# Altium schematic sheet 09- CAN.SchDoc: CAN
size 420 x 297 mm; Revision: 1.0; SheetNumber: 9; SheetTotal: 13; Project: LOW LEVEL ECU
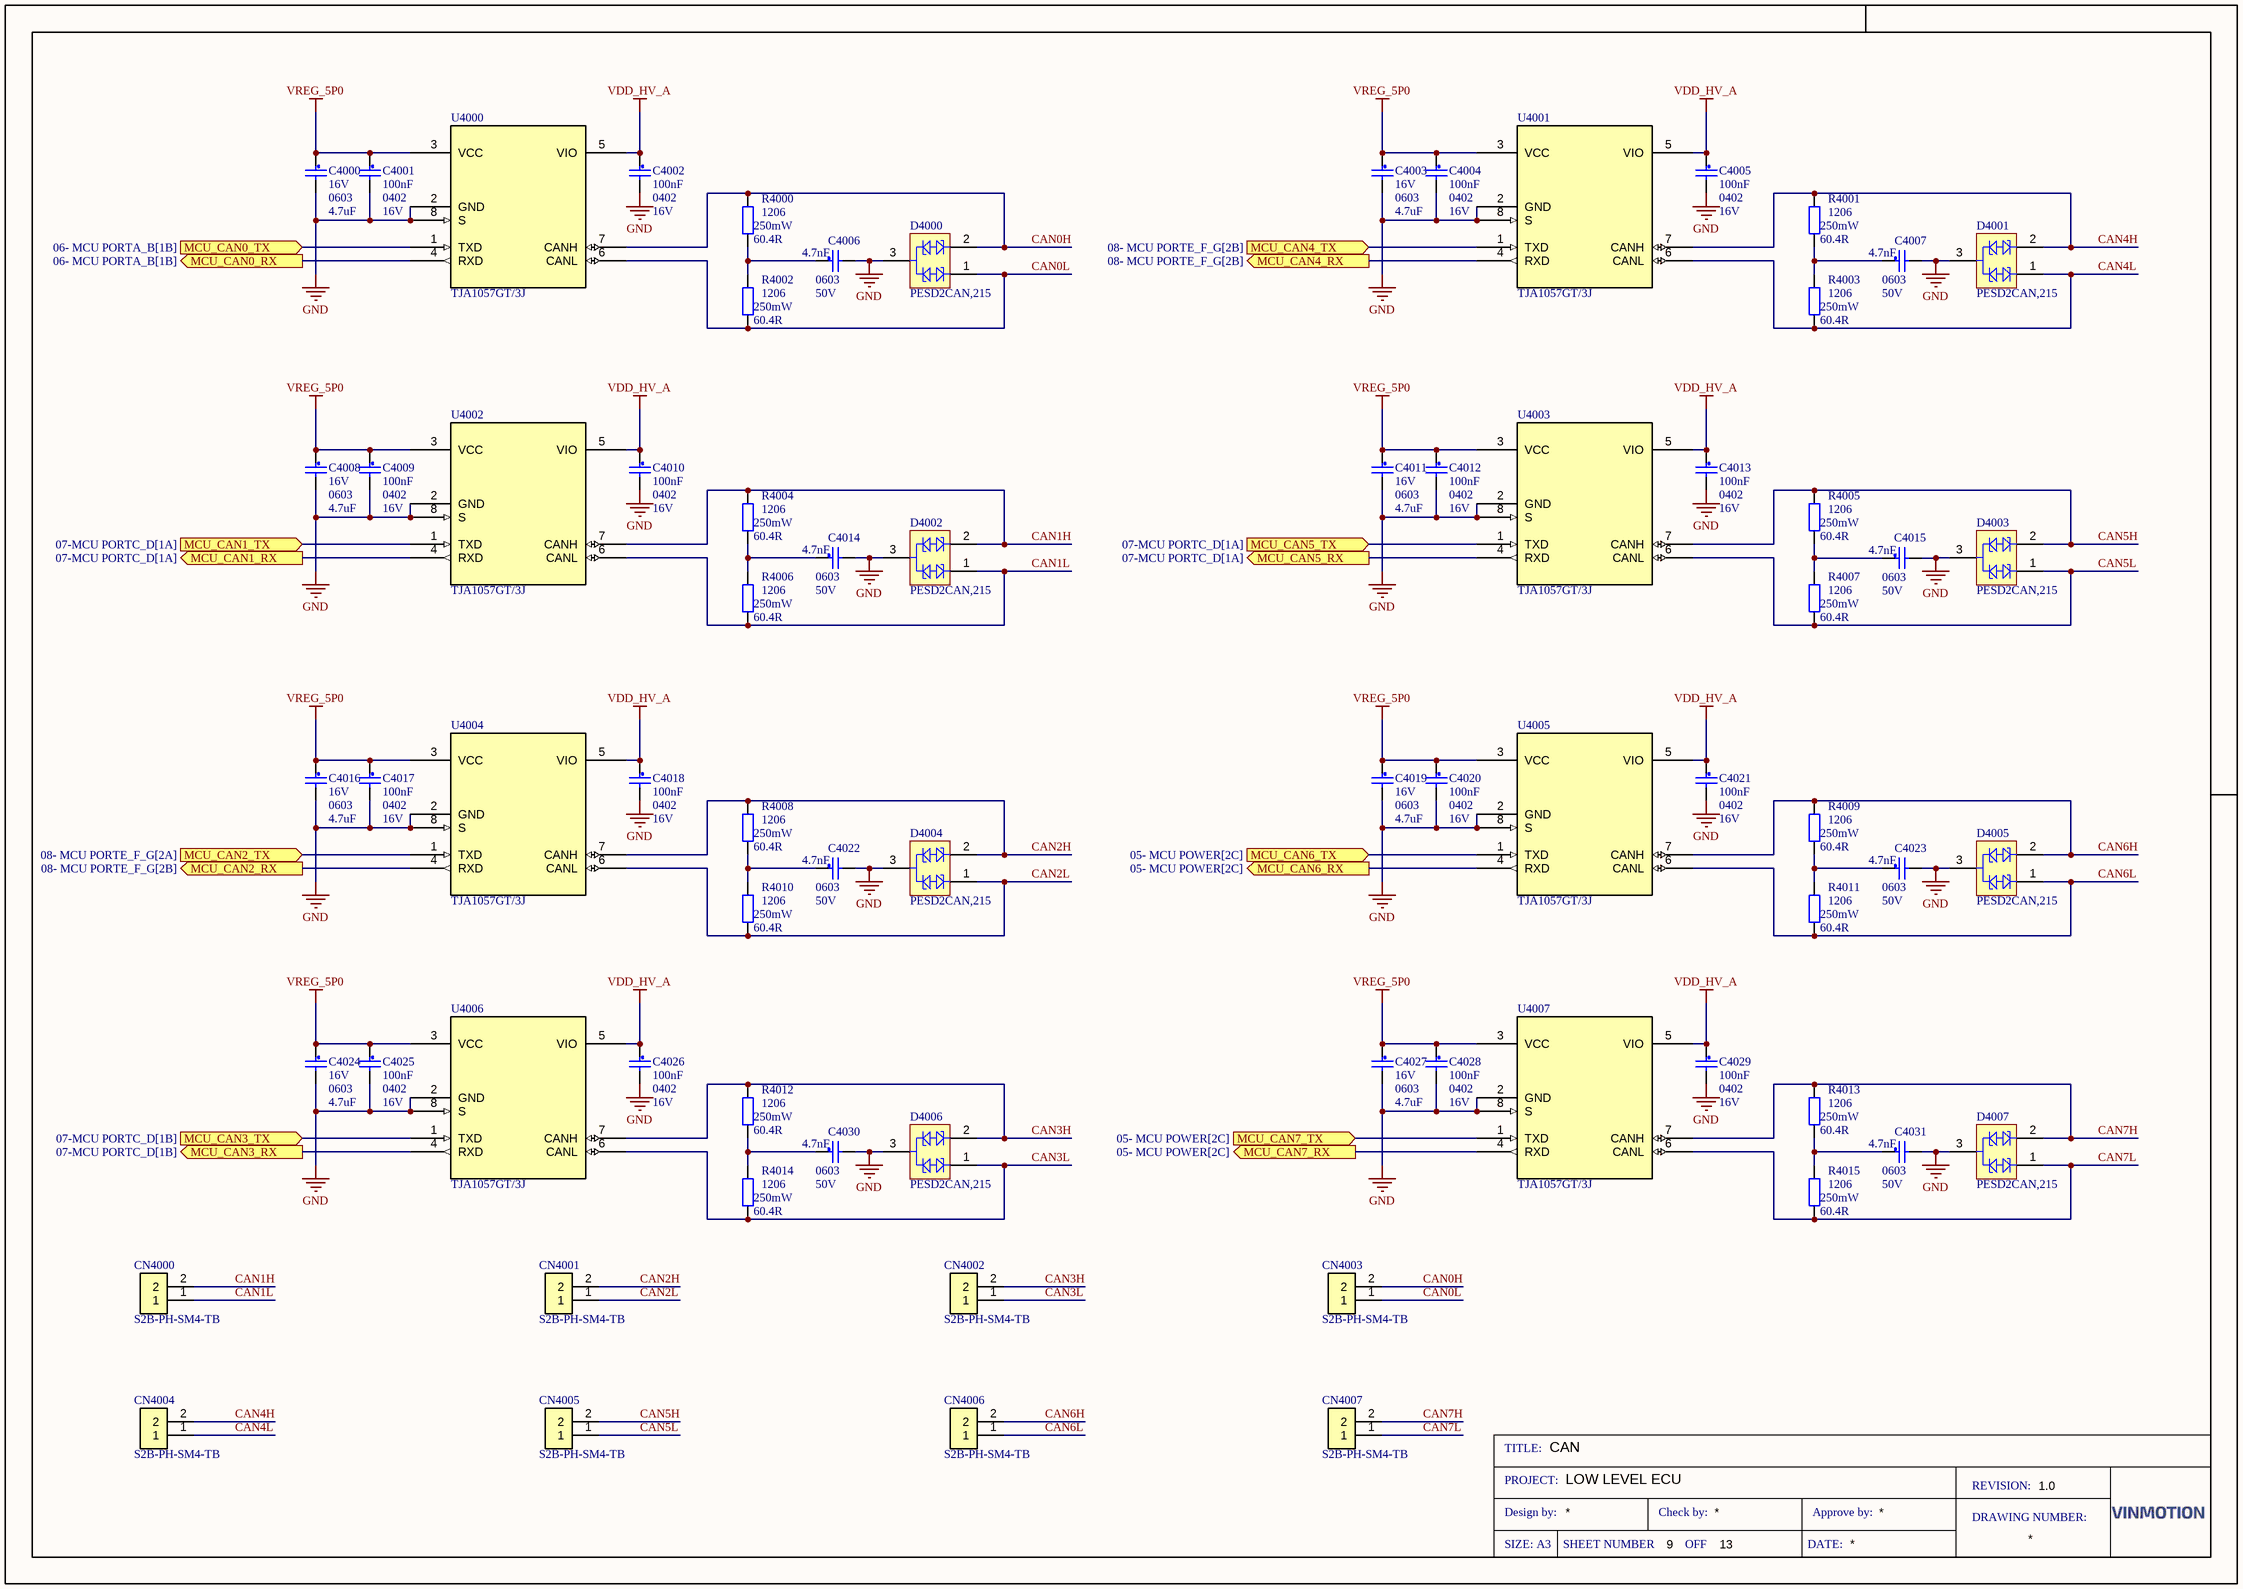
[diagram p0: 09- CAN.SchDoc]

## Parts
C4000  Voltage Rating: 16V  Case/Package: 0603  Capacitance: 4.7uF  [CAP0603]  (hidden comment: GRT188C81C475KE13D)
C4001  Capacitance: 100nF  Case/Package: 0402  Voltage Rating (DC): 16V  [CAP0402]  (hidden comment: 0402YC104KAT2A)
C4002  Capacitance: 100nF  Case/Package: 0402  Voltage Rating (DC): 16V  [CAP0402]  (hidden comment: 0402YC104KAT2A)
C4003  Voltage Rating: 16V  Case/Package: 0603  Capacitance: 4.7uF  [CAP0603]  (hidden comment: GRT188C81C475KE13D)
C4004  Capacitance: 100nF  Case/Package: 0402  Voltage Rating (DC): 16V  [CAP0402]  (hidden comment: 0402YC104KAT2A)
C4005  Capacitance: 100nF  Case/Package: 0402  Voltage Rating (DC): 16V  [CAP0402]  (hidden comment: 0402YC104KAT2A)
C4006  Case Code (Imperial): 0603  Voltage Rating: 50V  Capacitance: 4.7nF  [CAP0603]  (hidden comment: CL10B472KB8WPNC)
C4007  Case Code (Imperial): 0603  Voltage Rating: 50V  Capacitance: 4.7nF  [CAP0603]  (hidden comment: CL10B472KB8WPNC)
C4008  Voltage Rating: 16V  Case/Package: 0603  Capacitance: 4.7uF  [CAP0603]  (hidden comment: GRT188C81C475KE13D)
C4009  Capacitance: 100nF  Case/Package: 0402  Voltage Rating (DC): 16V  [CAP0402]  (hidden comment: 0402YC104KAT2A)
C4010  Capacitance: 100nF  Case/Package: 0402  Voltage Rating (DC): 16V  [CAP0402]  (hidden comment: 0402YC104KAT2A)
C4011  Voltage Rating: 16V  Case/Package: 0603  Capacitance: 4.7uF  [CAP0603]  (hidden comment: GRT188C81C475KE13D)
C4012  Capacitance: 100nF  Case/Package: 0402  Voltage Rating (DC): 16V  [CAP0402]  (hidden comment: 0402YC104KAT2A)
C4013  Capacitance: 100nF  Case/Package: 0402  Voltage Rating (DC): 16V  [CAP0402]  (hidden comment: 0402YC104KAT2A)
C4014  Case Code (Imperial): 0603  Voltage Rating: 50V  Capacitance: 4.7nF  [CAP0603]  (hidden comment: CL10B472KB8WPNC)
C4015  Case Code (Imperial): 0603  Voltage Rating: 50V  Capacitance: 4.7nF  [CAP0603]  (hidden comment: CL10B472KB8WPNC)
C4016  Voltage Rating: 16V  Case/Package: 0603  Capacitance: 4.7uF  [CAP0603]  (hidden comment: GRT188C81C475KE13D)
C4017  Capacitance: 100nF  Case/Package: 0402  Voltage Rating (DC): 16V  [CAP0402]  (hidden comment: 0402YC104KAT2A)
C4018  Capacitance: 100nF  Case/Package: 0402  Voltage Rating (DC): 16V  [CAP0402]  (hidden comment: 0402YC104KAT2A)
C4019  Voltage Rating: 16V  Case/Package: 0603  Capacitance: 4.7uF  [CAP0603]  (hidden comment: GRT188C81C475KE13D)
C4020  Capacitance: 100nF  Case/Package: 0402  Voltage Rating (DC): 16V  [CAP0402]  (hidden comment: 0402YC104KAT2A)
C4021  Capacitance: 100nF  Case/Package: 0402  Voltage Rating (DC): 16V  [CAP0402]  (hidden comment: 0402YC104KAT2A)
C4022  Case Code (Imperial): 0603  Voltage Rating: 50V  Capacitance: 4.7nF  [CAP0603]  (hidden comment: CL10B472KB8WPNC)
C4023  Case Code (Imperial): 0603  Voltage Rating: 50V  Capacitance: 4.7nF  [CAP0603]  (hidden comment: CL10B472KB8WPNC)
C4024  Voltage Rating: 16V  Case/Package: 0603  Capacitance: 4.7uF  [CAP0603]  (hidden comment: GRT188C81C475KE13D)
C4025  Capacitance: 100nF  Case/Package: 0402  Voltage Rating (DC): 16V  [CAP0402]  (hidden comment: 0402YC104KAT2A)
C4026  Capacitance: 100nF  Case/Package: 0402  Voltage Rating (DC): 16V  [CAP0402]  (hidden comment: 0402YC104KAT2A)
C4027  Voltage Rating: 16V  Case/Package: 0603  Capacitance: 4.7uF  [CAP0603]  (hidden comment: GRT188C81C475KE13D)
C4028  Capacitance: 100nF  Case/Package: 0402  Voltage Rating (DC): 16V  [CAP0402]  (hidden comment: 0402YC104KAT2A)
C4029  Capacitance: 100nF  Case/Package: 0402  Voltage Rating (DC): 16V  [CAP0402]  (hidden comment: 0402YC104KAT2A)
C4030  Case Code (Imperial): 0603  Voltage Rating: 50V  Capacitance: 4.7nF  [CAP0603]  (hidden comment: CL10B472KB8WPNC)
C4031  Case Code (Imperial): 0603  Voltage Rating: 50V  Capacitance: 4.7nF  [CAP0603]  (hidden comment: CL10B472KB8WPNC)
CN4000  S2B-PH-SM4-TB  [S2B-PH-SM4-TB]
CN4001  S2B-PH-SM4-TB  [S2B-PH-SM4-TB]
CN4002  S2B-PH-SM4-TB  [S2B-PH-SM4-TB]
CN4003  S2B-PH-SM4-TB  [S2B-PH-SM4-TB]
CN4004  S2B-PH-SM4-TB  [S2B-PH-SM4-TB]
CN4005  S2B-PH-SM4-TB  [S2B-PH-SM4-TB]
CN4006  S2B-PH-SM4-TB  [S2B-PH-SM4-TB]
CN4007  S2B-PH-SM4-TB  [S2B-PH-SM4-TB]
D4000  PESD2CAN,215  [NEXPERIA_PESD2CAN,215_N]
D4001  PESD2CAN,215  [NEXPERIA_PESD2CAN,215_N]
D4002  PESD2CAN,215  [NEXPERIA_PESD2CAN,215_N]
D4003  PESD2CAN,215  [NEXPERIA_PESD2CAN,215_N]
D4004  PESD2CAN,215  [NEXPERIA_PESD2CAN,215_N]
D4005  PESD2CAN,215  [NEXPERIA_PESD2CAN,215_N]
D4006  PESD2CAN,215  [NEXPERIA_PESD2CAN,215_N]
D4007  PESD2CAN,215  [NEXPERIA_PESD2CAN,215_N]
R4000  Max Power Dissipation: 250mW  Resistance: 60.4R  Case/Package: 1206  [RES1206]  (hidden comment: RMCF1206FT60R4)
R4001  Max Power Dissipation: 250mW  Resistance: 60.4R  Case/Package: 1206  [RES1206]  (hidden comment: RMCF1206FT60R4)
R4002  Max Power Dissipation: 250mW  Resistance: 60.4R  Case/Package: 1206  [RES1206]  (hidden comment: RMCF1206FT60R4)
R4003  Max Power Dissipation: 250mW  Resistance: 60.4R  Case/Package: 1206  [RES1206]  (hidden comment: RMCF1206FT60R4)
R4004  Max Power Dissipation: 250mW  Resistance: 60.4R  Case/Package: 1206  [RES1206]  (hidden comment: RMCF1206FT60R4)
R4005  Max Power Dissipation: 250mW  Resistance: 60.4R  Case/Package: 1206  [RES1206]  (hidden comment: RMCF1206FT60R4)
R4006  Max Power Dissipation: 250mW  Resistance: 60.4R  Case/Package: 1206  [RES1206]  (hidden comment: RMCF1206FT60R4)
R4007  Max Power Dissipation: 250mW  Resistance: 60.4R  Case/Package: 1206  [RES1206]  (hidden comment: RMCF1206FT60R4)
R4008  Max Power Dissipation: 250mW  Resistance: 60.4R  Case/Package: 1206  [RES1206]  (hidden comment: RMCF1206FT60R4)
R4009  Max Power Dissipation: 250mW  Resistance: 60.4R  Case/Package: 1206  [RES1206]  (hidden comment: RMCF1206FT60R4)
R4010  Max Power Dissipation: 250mW  Resistance: 60.4R  Case/Package: 1206  [RES1206]  (hidden comment: RMCF1206FT60R4)
R4011  Max Power Dissipation: 250mW  Resistance: 60.4R  Case/Package: 1206  [RES1206]  (hidden comment: RMCF1206FT60R4)
R4012  Max Power Dissipation: 250mW  Resistance: 60.4R  Case/Package: 1206  [RES1206]  (hidden comment: RMCF1206FT60R4)
R4013  Max Power Dissipation: 250mW  Resistance: 60.4R  Case/Package: 1206  [RES1206]  (hidden comment: RMCF1206FT60R4)
R4014  Max Power Dissipation: 250mW  Resistance: 60.4R  Case/Package: 1206  [RES1206]  (hidden comment: RMCF1206FT60R4)
R4015  Max Power Dissipation: 250mW  Resistance: 60.4R  Case/Package: 1206  [RES1206]  (hidden comment: RMCF1206FT60R4)
U4000  TJA1057GT/3J  [SOIC127P590X175-8N]
U4001  TJA1057GT/3J  [SOIC127P590X175-8N]
U4002  TJA1057GT/3J  [SOIC127P590X175-8N]
U4003  TJA1057GT/3J  [SOIC127P590X175-8N]
U4004  TJA1057GT/3J  [SOIC127P590X175-8N]
U4005  TJA1057GT/3J  [SOIC127P590X175-8N]
U4006  TJA1057GT/3J  [SOIC127P590X175-8N]
U4007  TJA1057GT/3J  [SOIC127P590X175-8N]

## Ports
MCU_CAN0_RX (out, see 06- MCU PORTA_B[1B]), MCU_CAN0_TX (in, see 06- MCU PORTA_B[1B]), MCU_CAN1_RX (out, see 07-MCU PORTC_D[1A]), MCU_CAN1_TX (in, see 07-MCU PORTC_D[1A]), MCU_CAN2_RX (out, see 08- MCU PORTE_F_G[2B]), MCU_CAN2_TX (in, see 08- MCU PORTE_F_G[2A]), MCU_CAN3_RX (out, see 07-MCU PORTC_D[1B]), MCU_CAN3_TX (in, see 07-MCU PORTC_D[1B]), MCU_CAN4_RX (out, see 08- MCU PORTE_F_G[2B]), MCU_CAN4_TX (in, see 08- MCU PORTE_F_G[2B]), MCU_CAN5_RX (out, see 07-MCU PORTC_D[1A]), MCU_CAN5_TX (in, see 07-MCU PORTC_D[1A]), MCU_CAN6_RX (out, see 05- MCU POWER[2C]), MCU_CAN6_TX (in, see 05- MCU POWER[2C]), MCU_CAN7_RX (out, see 05- MCU POWER[2C]), MCU_CAN7_TX (in, see 05- MCU POWER[2C])

## Nets
GND: C4000.2 C4001.2 C4002.2 C4003.2 C4004.2 C4005.2 C4006.2 C4007.2 C4008.2 C4009.2 C4010.2 C4011.2 C4012.2 C4013.2 C4014.2 C4015.2 C4016.2 C4017.2 C4018.2 C4019.2 C4020.2 C4021.2 C4022.2 C4023.2 C4024.2 C4025.2 C4026.2 C4027.2 C4028.2 C4029.2 C4030.2 C4031.2 D4000.3 D4001.3 D4002.3 D4003.3 D4004.3 D4005.3 D4006.3 D4007.3 U4000.2(GND) U4000.8(S) U4001.2(GND) U4001.8(S) U4002.2(GND) U4002.8(S) U4003.2(GND) U4003.8(S) U4004.2(GND) U4004.8(S) U4005.2(GND) U4005.8(S) U4006.2(GND) U4006.8(S) U4007.2(GND) U4007.8(S)
VDD_HV_A: C4002.1 C4005.1 C4010.1 C4013.1 C4018.1 C4021.1 C4026.1 C4029.1 U4000.5(VIO) U4001.5(VIO) U4002.5(VIO) U4003.5(VIO) U4004.5(VIO) U4005.5(VIO) U4006.5(VIO) U4007.5(VIO)
VREG_5P0: C4000.1 C4001.1 C4003.1 C4004.1 C4008.1 C4009.1 C4011.1 C4012.1 C4016.1 C4017.1 C4019.1 C4020.1 C4024.1 C4025.1 C4027.1 C4028.1 U4000.3(VCC) U4001.3(VCC) U4002.3(VCC) U4003.3(VCC) U4004.3(VCC) U4005.3(VCC) U4006.3(VCC) U4007.3(VCC)
CAN0H: CN4003.2 D4000.2 R4000.1 U4000.7(CANH)
CAN0L: CN4003.1 D4000.1 R4002.2 U4000.6(CANL)
CAN1H: CN4000.2 D4002.2 R4004.1 U4002.7(CANH)
CAN1L: CN4000.1 D4002.1 R4006.2 U4002.6(CANL)
CAN2H: CN4001.2 D4004.2 R4008.1 U4004.7(CANH)
CAN2L: CN4001.1 D4004.1 R4010.2 U4004.6(CANL)
CAN3H: CN4002.2 D4006.2 R4012.1 U4006.7(CANH)
CAN3L: CN4002.1 D4006.1 R4014.2 U4006.6(CANL)
CAN4H: CN4004.2 D4001.2 R4001.1 U4001.7(CANH)
CAN4L: CN4004.1 D4001.1 R4003.2 U4001.6(CANL)
CAN5H: CN4005.2 D4003.2 R4005.1 U4003.7(CANH)
CAN5L: CN4005.1 D4003.1 R4007.2 U4003.6(CANL)
CAN6H: CN4006.2 D4005.2 R4009.1 U4005.7(CANH)
CAN6L: CN4006.1 D4005.1 R4011.2 U4005.6(CANL)
CAN7H: CN4007.2 D4007.2 R4013.1 U4007.7(CANH)
CAN7L: CN4007.1 D4007.1 R4015.2 U4007.6(CANL)
MCU_CAN0_RX: U4000.4(RXD) ; port MCU_CAN0_RX
MCU_CAN0_TX: U4000.1(TXD) ; port MCU_CAN0_TX
MCU_CAN1_RX: U4002.4(RXD) ; port MCU_CAN1_RX
MCU_CAN1_TX: U4002.1(TXD) ; port MCU_CAN1_TX
MCU_CAN2_RX: U4004.4(RXD) ; port MCU_CAN2_RX
MCU_CAN2_TX: U4004.1(TXD) ; port MCU_CAN2_TX
MCU_CAN3_RX: U4006.4(RXD) ; port MCU_CAN3_RX
MCU_CAN3_TX: U4006.1(TXD) ; port MCU_CAN3_TX
MCU_CAN4_RX: U4001.4(RXD) ; port MCU_CAN4_RX
MCU_CAN4_TX: U4001.1(TXD) ; port MCU_CAN4_TX
MCU_CAN5_RX: U4003.4(RXD) ; port MCU_CAN5_RX
MCU_CAN5_TX: U4003.1(TXD) ; port MCU_CAN5_TX
MCU_CAN6_RX: U4005.4(RXD) ; port MCU_CAN6_RX
MCU_CAN6_TX: U4005.1(TXD) ; port MCU_CAN6_TX
MCU_CAN7_RX: U4007.4(RXD) ; port MCU_CAN7_RX
MCU_CAN7_TX: U4007.1(TXD) ; port MCU_CAN7_TX
NetC4006_1: C4006.1 R4000.2 R4002.1
NetC4007_1: C4007.1 R4001.2 R4003.1
NetC4014_1: C4014.1 R4004.2 R4006.1
NetC4015_1: C4015.1 R4005.2 R4007.1
NetC4022_1: C4022.1 R4008.2 R4010.1
NetC4023_1: C4023.1 R4009.2 R4011.1
NetC4030_1: C4030.1 R4012.2 R4014.1
NetC4031_1: C4031.1 R4013.2 R4015.1

## Notes on the sheet
- TITLE:
- PROJECT:
- Design by:
- Check by:
- Approve by:
- DRAWING NUMBER:
- REVISION:
- SIZE: A3
- SHEET NUMBER
- OFF
- DATE:

## Library data of the parts
C4000 C4003 C4008 C4011 C4016 C4019 C4024 C4027 = CMP-00351-2: CAP CER 4.7uF 16V 10% X6S 0603 SMD; Manufacturer 1: Murata Electronics; Crossable(YES/NO): YES; Case Code (Imperial): 0603; Tolerance: 10%; Packaging: Tape and Reel; Width: 0.031inch; Case Code (Metric): 1608; Mount Type(SMD/TH): SMD; Min Operating Temperature: -55°C; Max Operating Temperature: 105°C; Mount: Surface Mount; Thickness: 0.035inch; Manufacturer Part Number 1: GRT188C81C475KE13D; Ratings: AEC-Q200; Length: 0.063inch; Height: 0.8mm; Lead Free: Lead Free; Voltage Rating (DC): 16V
C4001 C4002 C4004 C4005 C4009 C4010 C4012 C4013 C4017 C4018 C4020 C4021 C4025 C4026 C4028 C4029 = CMP-00988-1: CAP CER 0.1UF 16V X7R 0402; Manufacturer 1: KYOCERA AVX; Crossable(YES/NO): YES; Mount Type(SMD/TH): SMD; Case Code (Imperial): 0402; Case Code (Metric): 1005; Dielectric: X7R; Manufacturer Part Number 1: 0402YC104KAT2A; Max Operating Temperature: 125°C; Min Operating Temperature: -55°C; Mount: Surface Mount; Voltage Rating: 16V
C4006 C4007 C4014 C4015 C4022 C4023 C4030 C4031 = CMP-00892-1: CAP CER 4700PF 50V X7R 0603; Manufacturer 1: Samsung; Tolerance: 10%; Crossable(YES/NO): YES; Mount Type(SMD/TH): SMD; Supplier 1: Digi-Key; Manufacturer Part Number 1: CL10B472KB8WPNC; Stock 1: 165107; Pricing 1: 1=0.10000, 10=0.04900, 100=0.02180, 500=0.01558, 1000=0.01224 (USD); RoHS: Yes; Mount: Surface Mount; Case/Package: 0603; Case Code (Metric): 1608; Min Operating Temperature: -55°C; Max Operating Temperature: 125°C; Features: Soft Termination; Packaging: Tape and Reel; Length: 0.063inch; Width: 0.031inch; Thickness: 0.035inch; Ratings: AEC-Q200; ComponentLink1URL: http://www.samsungsem.com/kr/support/library/product-catalog/mlcc.jsp?src-supplier=Digi-Key; ComponentLink1Description: http://www.samsungsem.com/kr/support/library/product-catalog/mlcc.jsp?src-supplier=Digi-Key; ComponentLink2URL: http://www.samsungsem.com/servlet/FileDownload?filename=productcatalog/pdf/MLCC.pdf&src-supplier=Avnet; ComponentLink2Description: http://www.samsungsem.com/servlet/FileDownload?filename=productcatalog/pdf/MLCC.pdf&src-supplier=Avnet; Supplier Part Number 1: 1276-6532-1-ND; Height: 0.8mm; Lead Free: Lead Free; Voltage Rating (DC): 50V
CN4000-CN4007 = CMP-01142-1: CONN HEADER SMD R/A 2POS 2MM; Manufacturer: JST; Manufacturer Part Number: S2BPHSM4TBLFSN; Current Rating: 2A; Insulation Resistance: 1GΩ; Number of Contacts: 2; Voltage Rating: 100V; Housing Color: Natural; Category: Headers and Wire Housings; Color: White; Contact Material: Copper, Tin; Contact Plating: Tin; Height: 5.5mm; Housing Material: Nylon; Lead Free: Lead Free; Lead Pitch: 2mm; Max Operating Temperature: 85°C; Min Operating Temperature: -25°C; Number of Positions: 2; Number of Rows: 1; RoHS: Compliant; Voltage Rating (AC): 100V
D4000-D4007 = CMP-ROOT-0006-8: DIODE TVS 24VWM 41VC SOT-23-3; Manufacturer 1: Nexperia USA Inc.; Min Breakdown Voltage: 26.2V; Breakdown Voltage: 28V; Test Current: 1mA; Number of Bidirectional Channels: 2; Reverse Standoff Voltage: 24V; Max Breakdown Voltage: 30.3V; ESD Protection: Yes; Peak Pulse Current: 5A; Mount Type(SMD/TH): SMD; Direction: Bidirectional; Max Reverse Leakage Current: 10nA; Element Configuration: Dual; Max Power Dissipation: 230W; Power Line Protection: No; Leakage Current: 50nA; Clamping Voltage: 41V; Capacitance: 17pF; Radiation Hardening: No; Manufacturer Part Number 1: PESD2CAN,215; Lead Free: Lead Free; Max Operating Temperature: 150°C; Mount: Surface Mount; REACH SVHC: No SVHC; Crossable(YES/NO): YES; Termination: SMD/SMT; Number of Elements: 2; Weight: 0.01lb; Contact Plating: Tin; Number of Channels: 2; Depth: 1.4mm; Packaging: Tape and Reel; Length: 3mm; Height: 1mm; Case/Package: SOT-23; Composition: Zener; Peak Pulse Power: 230W; Number of Pins: 3; Reverse Breakdown Voltage: 26.2V; Working Voltage: 24V; Max Surge Current: 5A; Min Operating Temperature: -65°C; Polarity: Bidirectional; Package Quantity: 1; Width: 1.4mm
R4000-R4015 = CMP-00099-3: RES 60.4R 1/4W 1% 1206 SMD; Manufacturer 1: Stackpole Electronics Inc; Temperature Coefficient: 100ppm/°C; Crossable(YES/NO): YES; Packaging: Tape and Reel; Number of Terminations: 2; Mount: Surface Mount; Width: 0.063inch; Features: Automotive AEC-Q200; Contact Plating: Tin,Matte; Manufacturer Part Number 1: RMCF1206FT60R4; Min Operating Temperature: -55°C; Height: 0.028inch; Mount Type(SMD/TH): SMD; Radiation Hardening: No; Case Code (Imperial): 1206; Max Operating Temperature: 155°C; Length: 0.126inch; Composition: Thick Film; Tolerance: 1%; Case Code (Metric): 3216
U4000-U4007 = CMP-01192-1: 1/1 Transceiver Half CANbus 8-SO; Manufacturer: NXP Semiconductors; Interface: CAN, LIN; Max Junction Temperature (Tj): 150°C; Max Supply Voltage: 5.25V; Min Supply Voltage: 4.75V; Number of Circuits: 1; Operating Supply Voltage: 5V; Receiver Hysteresis: 300mV; Simplex/Duplex: Half Duplex; Category: CAN Transceivers; Case/Package: SOIC; Height: 1.75mm; Height - Seated (Max): 1.75mm; Length: 4.9mm; Lifecycle Status: NRND; Manufacturer Part Number: TJA1057GT/3J; Max Operating Temperature: 150°C; Min Operating Temperature: -40°C; Mounting Technology: Surface Mount; Number of Terminals: 8; Packaging: Cut Tape; REACH SVHC: Yes; RoHS: Compliant; Schedule B: 8542390000, 8542390000|8542390000|8542390000|8542390000|8542390000; Terminal Pitch: 1.27mm; Width: 3.9mm